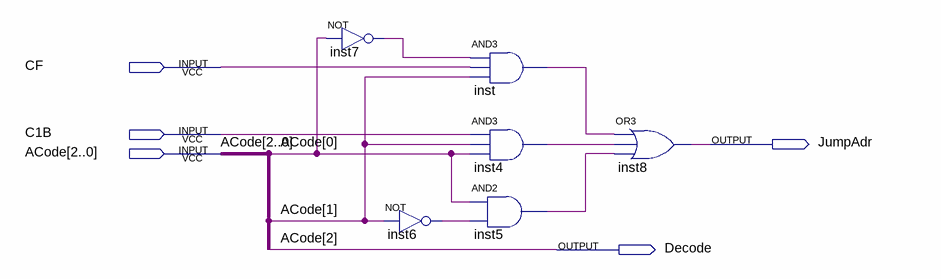
[diagram p0: schematic sheet]
// Quartus schematic ACode.bdf as structural Verilog: 6 symbols, 5 pins
module ACode (
  input  CF,
  input  C1B,
  input  [2:0] ACode,
  output JumpAdr,
  output Decode
);

  wire inst4_out, inst5_out, inst6_out, inst7_out, inst_out;

  not inst7 (inst7_out, ACode[0]);
  not inst6 (inst6_out, ACode[1]);
  and inst (inst_out, inst7_out, CF, ACode[1]);
  and inst4 (inst4_out, C1B, ACode[1], ACode[0]);
  and inst5 (inst5_out, ACode[0], inst6_out);
  or inst8 (JumpAdr, inst_out, inst4_out, inst5_out);

  assign Decode = ACode[2];
endmodule
